# Altium schematic sheet dmpro16-pcb-v1-FPGA.SchDoc
size A4; DocumentNumber: 4; SheetNumber: 4; SheetTotal: 17; SheetName: FPGA
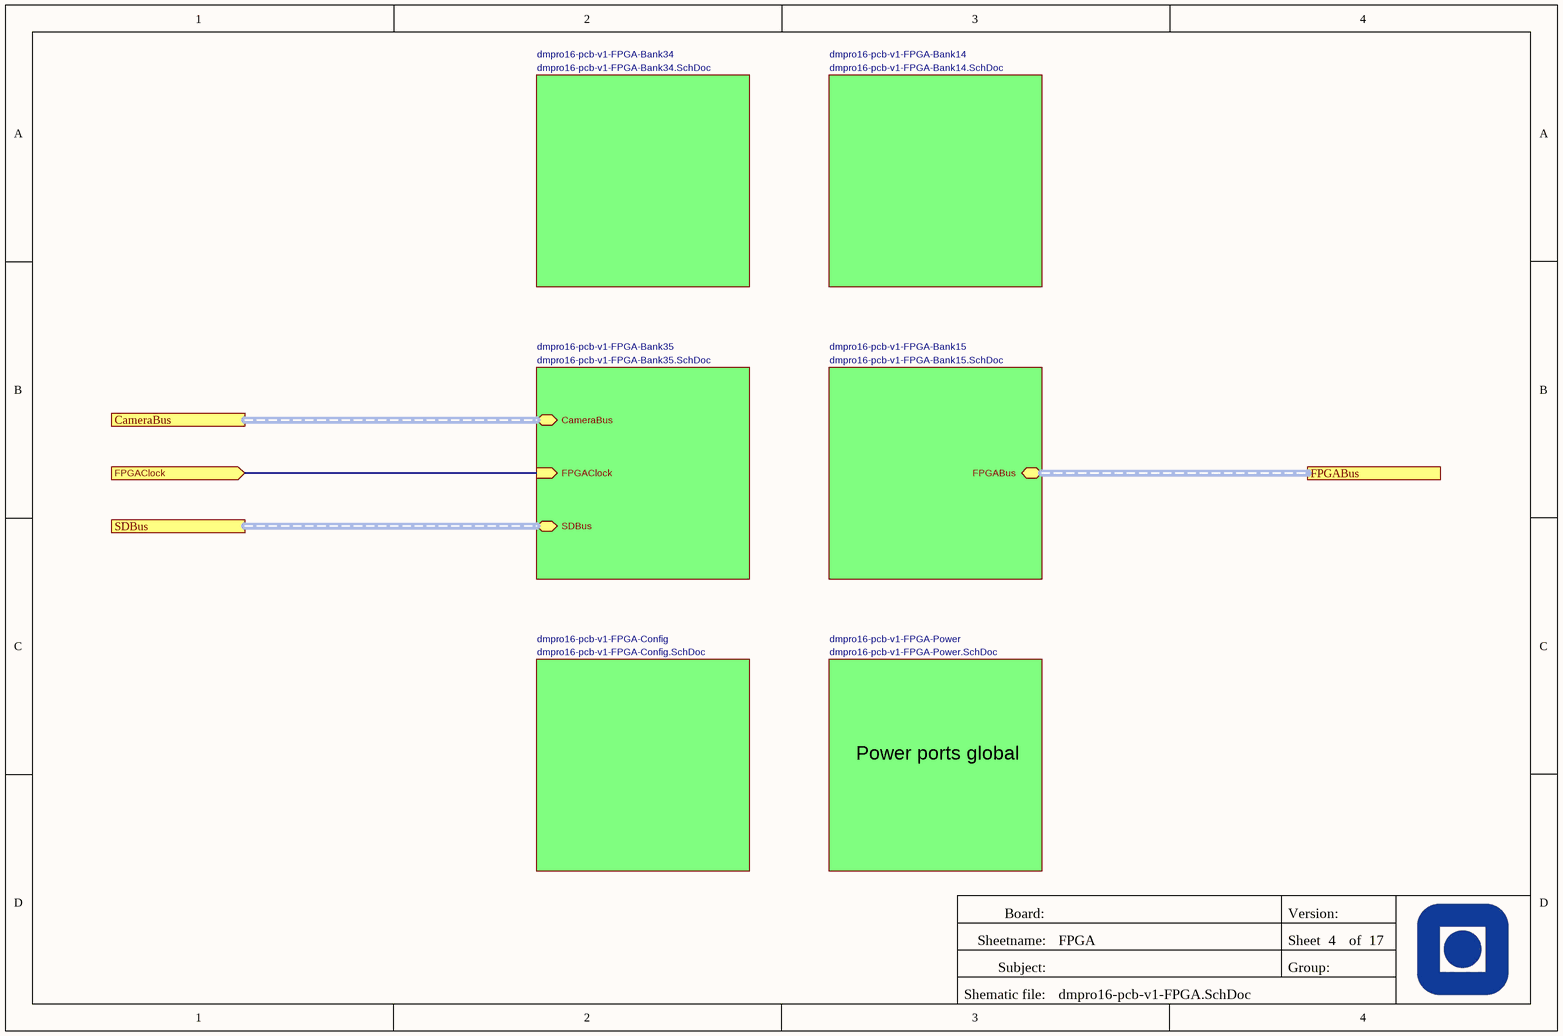
[diagram p0: dmpro16-pcb-v1-FPGA.SchDoc]

## Sub-sheets
dmpro16-pcb-v1-FPGA-Bank14 = dmpro16-pcb-v1-FPGA-Bank14.SchDoc: no entries
dmpro16-pcb-v1-FPGA-Bank15 = dmpro16-pcb-v1-FPGA-Bank15.SchDoc: FPGABus (harness FPGABus)
dmpro16-pcb-v1-FPGA-Bank34 = dmpro16-pcb-v1-FPGA-Bank34.SchDoc: no entries
dmpro16-pcb-v1-FPGA-Bank35 = dmpro16-pcb-v1-FPGA-Bank35.SchDoc: SDBus (harness SDBus), CameraBus (harness CameraBus), FPGAClock (in)
dmpro16-pcb-v1-FPGA-Config = dmpro16-pcb-v1-FPGA-Config.SchDoc: no entries
dmpro16-pcb-v1-FPGA-Power = dmpro16-pcb-v1-FPGA-Power.SchDoc: no entries

## Ports
CameraBus (harness CameraBus), FPGABus (harness FPGABus), FPGAClock (in), SDBus (harness SDBus)

## Nets
FPGAClock: port FPGAClock, sheet dmpro16-pcb-v1-FPGA-Bank35/FPGAClock

## Buses and harness runs
harness port CameraBus = sheet dmpro16-pcb-v1-FPGA-Bank35/CameraBus
harness port FPGABus = sheet dmpro16-pcb-v1-FPGA-Bank15/FPGABus
harness port SDBus = sheet dmpro16-pcb-v1-FPGA-Bank35/SDBus

## Notes on the sheet
- Power ports global
- Board:
- Version:
- Sheetname:
- Subject:
- Group:
- Sheet
- of
- Shematic file: